# EAGLE design aspirin_carrier_board (EAGLE 6.1)
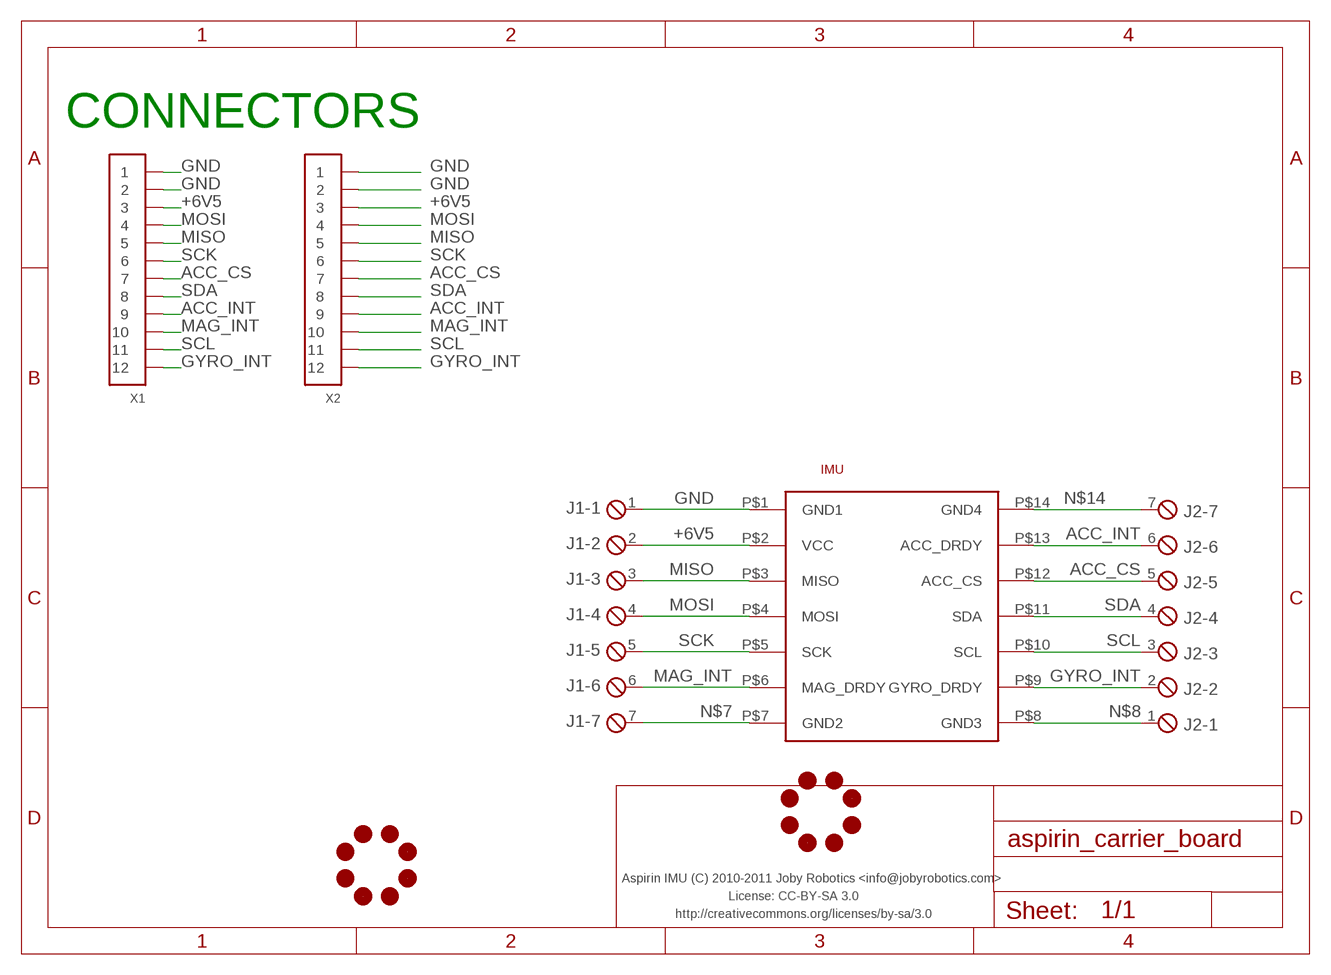
[diagram p0: schematic, sheet 1]

## Parts
IMU  ASPIRIN  [ASPIRIN_1]
J1  MPT7  [7POL254]
J2  MPT7  [7POL254]
JL1  JOBY_LOGO-6MIL  [JOBY_LOGO_6MIL]
JL2  JOBY_LOGO-6MIL  [JOBY_LOGO_6MIL]
X1  CONN_12-1-53047  [PB-53047-12]
X2  CONN_12-1-53261  [PB-53261-12]

## Nets
+6V5: IMU.P$2(VCC) J1.2 X1.3 X2.3
ACC_CS: IMU.P$12(ACC_CS) J2.5 X1.7 X2.7
ACC_INT: IMU.P$13(ACC_DRDY) J2.6 X1.9 X2.9
GND: IMU.P$1(GND1) J1.1 X1.1 X1.2 X2.1 X2.2
GYRO_INT: IMU.P$9(GYRO_DRDY) J2.2 X1.12 X2.12
MAG_INT: IMU.P$6(MAG_DRDY) J1.6 X1.10 X2.10
MISO: IMU.P$3(MISO) J1.3 X1.5 X2.5
MOSI: IMU.P$4(MOSI) J1.4 X1.4 X2.4
N$7: IMU.P$7(GND2) J1.7
N$8: IMU.P$8(GND3) J2.1
N$14: IMU.P$14(GND4) J2.7
SCK: IMU.P$5(SCK) J1.5 X1.6 X2.6
SCL: IMU.P$10(SCL) J2.3 X1.11 X2.11
SDA: IMU.P$11(SDA) J2.4 X1.8 X2.8

## Notes on the sheet
- CONNECTORS
- Aspirin IMU (C) 2010-2011 Joby Robotics <info@jobyrobotics.com>
- License: CC-BY-SA 3.0
- http://creativecommons.org/licenses/by-sa/3.0

## Library data of the parts
IMU = joby_robotics:ASPIRIN
J1 J2 = con-phoenix-254:MPT7: PHOENIX CONNECTOR
JL1 JL2 = aspirin:JOBY_LOGO
X1 X2 = pel_molex:CONN_12-1

## Board
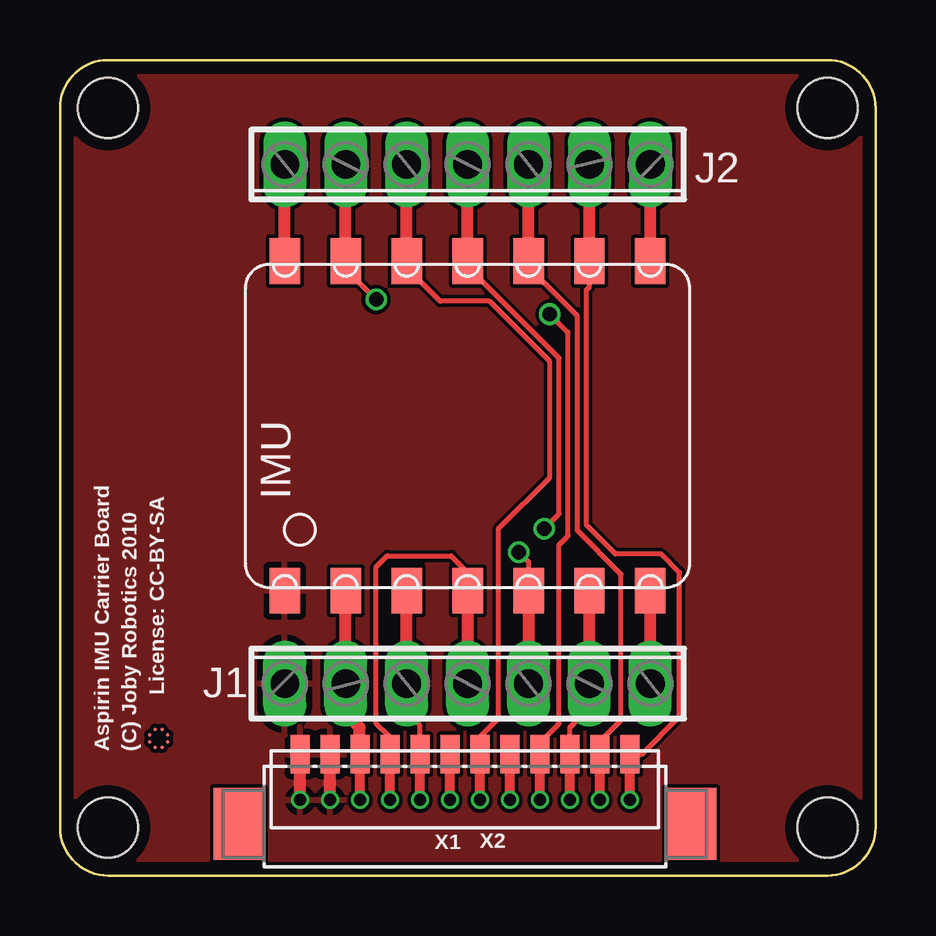
[diagram p1: board, top side]
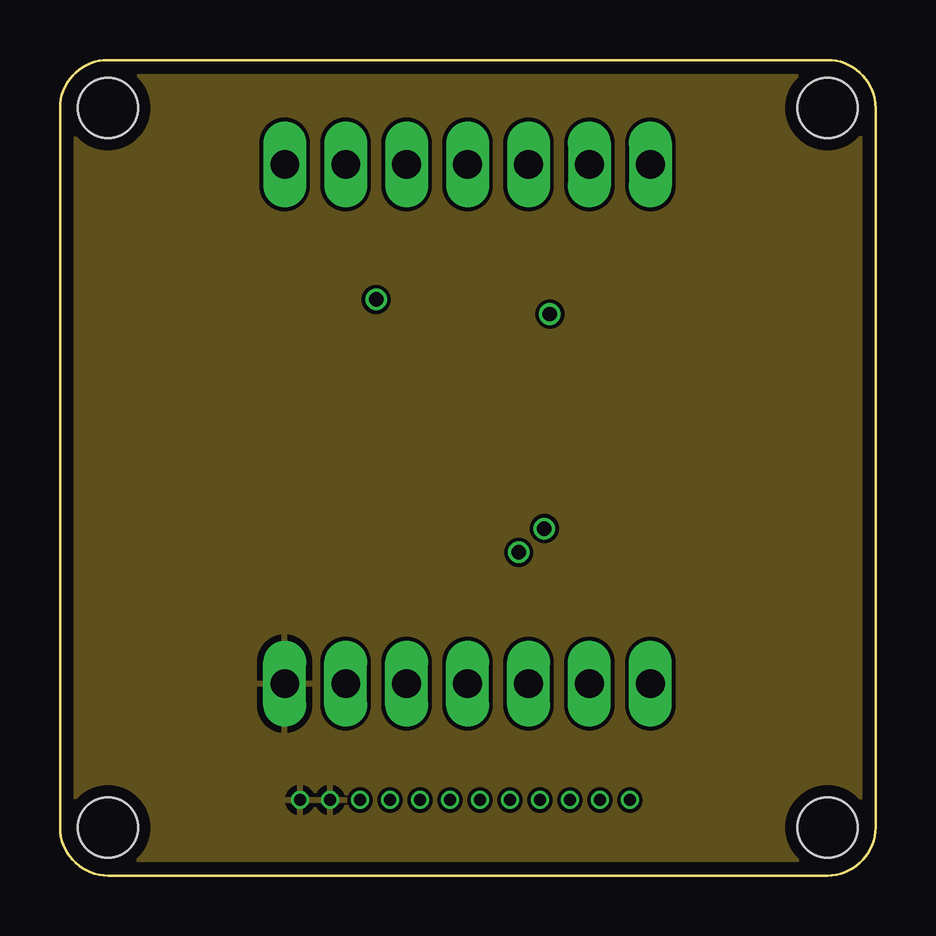
[diagram p2: board, inner layer Route2]
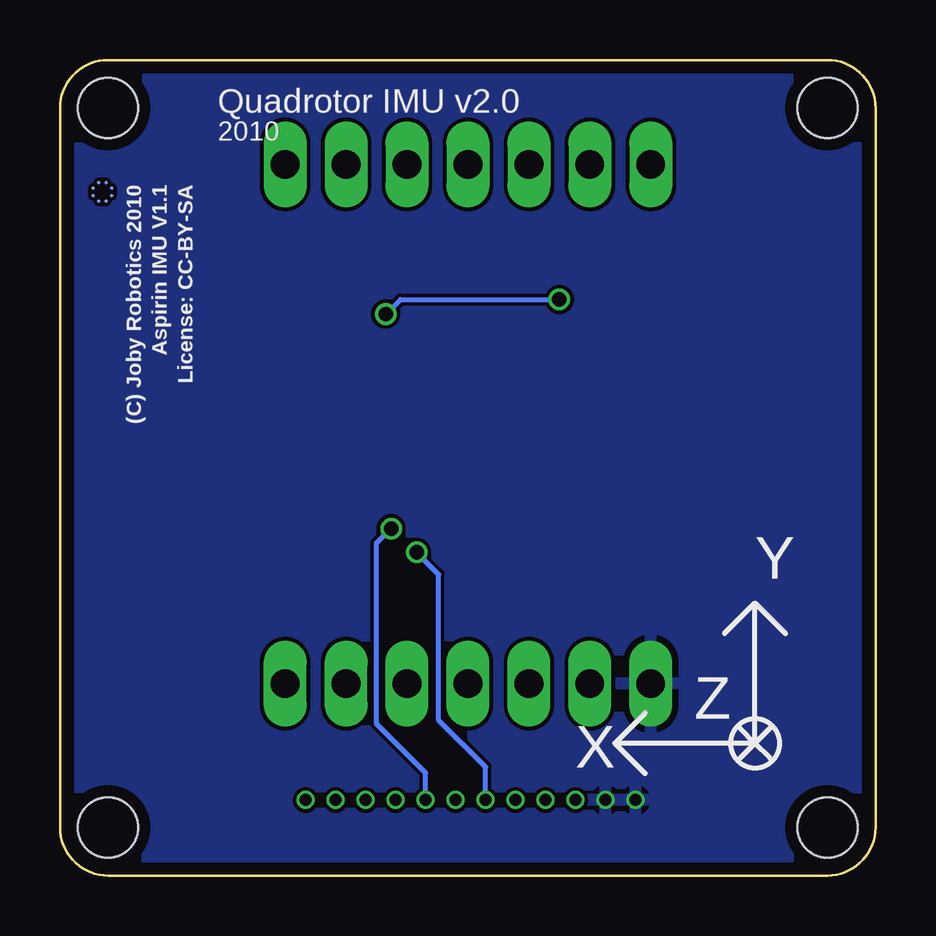
[diagram p3: board, bottom side, seen from below]

Size 34 x 34 mm. Coordinates in mm from the lower left corner, seen from the top.
Outline: 2,34 32,34 arc-90 34,32 34,2 arc-90 32,0 2,0 arc-90 0,2 0,32 arc-90 2,34
Copper layers (1*2+15*16): Top 0.035mm / dielectric 0.2mm / Route2 0.035mm / dielectric 1.5mm / Route15 0.035mm / dielectric 0.2mm / Bottom 0.035mm
Design rules: minimum track width 0.15mm, minimum drill 0.35mm, track to track 6mil, track to pad 6mil, pad to pad 6mil, via to via 6mil, smd to smd 6mil, copper to edge 20mil, drill to drill 8mil, minimum pad ring 0.1mm, minimum via ring 0.1mm, stop-mask expansion 4mil, vias tented up to drill 0mil, thermal gap 10mil
Holes 2.5 mm at 2,32 32,32 32,2 2,2

### Footprints (pad centres in the part's own frame; a part is rotated, then mirrored left to right if it is on the bottom)
ASPIRIN_1 = smd 1.905 x 1.27: P$1 -6.87,7.62; P$2 -6.87,5.08; P$3 -6.87,2.54; P$4 -6.87,0; P$5 -6.87,-2.54; P$6 -6.87,-5.08; P$7 -6.87,-7.62; P$8 6.87,-7.62; P$9 6.87,-5.08; P$10 6.87,-2.54; P$11 6.87,0; P$12 6.87,2.54; P$13 6.87,5.08; P$14 6.87,7.62
7POL254 = drill 1.2 long: 1 -7.62,0; 2 -5.08,0; 3 -2.54,0; 4 0,0; 5 2.54,0; 6 5.08,0; 7 7.62,0
JOBY_LOGO_6MIL = smd 0.152 x 0.152: 1 -0.152,0.381; 2 0.152,0.381; 3 0.381,0.152; 4 0.381,-0.152; 5 0.152,-0.381; 6 -0.152,-0.381; 7 -0.381,-0.152; 8 -0.381,0.152
PB-53047-12 = drill 0.5: 1 -6.875,0; 2 -5.625,0; 3 -4.375,0; 4 -3.125,0; 5 -1.875,0; 6 -0.625,0; 7 0.625,0; 8 1.875,0; 9 3.125,0; 10 4.375,0; 11 5.625,0; 12 6.875,0
PB-53261-12 = smd 0.8 x 1.6: 1 -6.875,1.1; 2 -5.625,1.1; 3 -4.375,1.1; 4 -3.125,1.1; 5 -1.875,1.1; 6 -0.625,1.1; 7 0.625,1.1; 8 1.875,1.1; 9 3.125,1.1; 10 4.375,1.1; 11 5.625,1.1; 12 6.875,1.1 | smd 2.1 x 3: MNT1 -9.425,-1.8; MNT2 9.425,-1.8

### Placement (x,y rotation side)
IMU  16.99,18.75 90 top
J1  16.99,8 0 top
J2  16.99,29.64 180 top
JL1  32.23,28.5 0 bottom
JL2  4.11,5.71 0 top
X1  16.88,3.15 0 top
X2  16.88,3.96 0 top

### Tracks (layer width: path | path; a pad name or v marks a point on that pad's centre or on a via)
+6V5
  Top 0.406: X1.3 X2.3
  Top 0.508: X2.3 12.5,5.07 12.5,6.17 11.91,6.76 J1.2 IMU.P$2
ACC_CS
  Top 0.203: IMU.P$12 14.45,25.34 15.85,23.94 17.91,23.94 20.42,21.42 20.42,16.6 18.29,14.47 18.29,6.55 17.51,5.77 X2.7
  Top 0.406: X1.7 X2.7
  Top 0.508: IMU.P$12 J2.5
ACC_INT  (via drill 0.6)
  Top 0.203: IMU.P$13 11.91,25.29 v13.18,24.02 | v20.42,23.41 21.18,22.64 21.18,14.16 20.8,13.78 20.8,6.33 20.01,5.53 X2.9
  Top 0.406: X1.9 X2.9
  Top 0.508: IMU.P$13 J2.6
  Bottom 0.203: v13.18,24.02 19.81,24.02 v20.42,23.41
GND
  Top 0.508: X1.1 X2.1 | X1.2 X2.2
  pour Top (rank 6): 0,0 33.97,0 33.97,33.97 0,33.97
  pour Route2: 0,0 33.97,0 33.97,33.97 0,33.97
  pour Bottom: 0.08,34.14 34.21,34.14 34.21,0.3 0.08,0.3
GYRO_INT
  Top 0.203: IMU.P$9 22.07,24.52 21.95,24.4 21.95,14.62 23.16,13.4 25.07,13.4 25.83,12.64 25.83,6.63 24.27,5.06 X2.12
  Top 0.406: X1.12 X2.12
  Top 0.508: IMU.P$9 J2.2
MAG_INT
  Top 0.152: X2.10
  Top 0.203: X2.10 21.26,6.17 22.1,7.01 22.1,7.98 J1.6
  Top 0.406: X1.10 X2.10
  Top 0.508: J1.6 IMU.P$6
MISO
  Top 0.152: X2.5
  Top 0.203: X2.5 15.01,6.25 14.48,6.78 14.48,7.98 J1.3
  Top 0.406: X1.5 X2.5
  Top 0.508: J1.3 IMU.P$3
MOSI
  Top 0.203: X2.4 13.76,5.75 13.18,6.33 13.18,12.87 13.64,13.32 16.31,13.32 16.99,12.64 IMU.P$4
  Top 0.406: X1.4 X2.4
  Top 0.508: IMU.P$4 J1.4
N$7
  Top 0.508: J1.7 IMU.P$7
N$8
  Top 0.508: IMU.P$8 J2.1
N$14
  Top 0.508: IMU.P$14 J2.7
SCK  (via drill 0.6)
  Top 0.203: 19.51,11.9 IMU.P$5 19.53,13.07 v19.13,13.47
  Top 0.406: X1.6 X2.6
  Top 0.508: IMU.P$5 J1.5
  Bottom 0.203: X1.6 16.26,4.52 18.21,6.48 18.21,12.56 v19.13,13.47
SCL
  Top 0.203: 19.53,25.36 21.57,23.33 21.57,14.39 23.39,12.56 23.39,6.48 22.51,5.59 X2.11
  Top 0.305: 19.53,25.36 IMU.P$10
  Top 0.406: X1.11 X2.11
  Top 0.508: IMU.P$10 J2.3
SDA  (via drill 0.6)
  Top 0.203: IMU.P$11 16.99,25.39 20.8,21.58 20.8,15.08 v20.19,14.47
  Top 0.406: X1.8 X2.8
  Top 0.508: IMU.P$11 J2.4
  Bottom 0.203: X1.8 18.76,4.28 20.8,6.33 20.8,13.86 v20.19,14.47

### Text on the board
tPlace: License: CC-BY-SA | Aspirin IMU Carrier Board | (C) Joby Robotics 2010
bPlace: License: CC-BY-SA | Aspirin IMU V1.1 | (C) Joby Robotics 2010
bNames: Quadrotor IMU v2.0 | 2010 | Y | Z | X